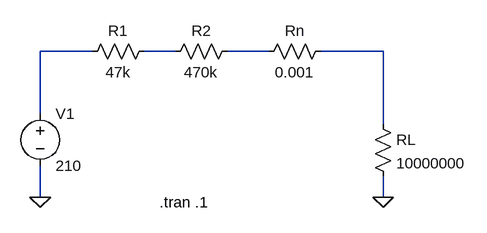
[diagram p0: schematic try2.asc]
try2.asc, the LTspice schematic file:
Version 4
SHEET 1 880 680
WIRE 96 64 16 64
WIRE 224 64 176 64
WIRE 368 64 304 64
WIRE 544 64 448 64
WIRE 16 160 16 64
WIRE 544 176 544 64
WIRE 16 288 16 240
WIRE 544 288 544 256
FLAG 16 288 0
FLAG 544 288 0
SYMBOL voltage 16 144 R0
WINDOW 123 0 0 Left 0
WINDOW 39 0 0 Left 0
SYMATTR InstName V1
SYMATTR Value 210
SYMBOL res 528 160 R0
SYMATTR InstName RL
SYMATTR Value 10000000
SYMBOL res 192 48 R90
WINDOW 0 0 56 VBottom 2
WINDOW 3 32 56 VTop 2
SYMATTR InstName R1
SYMATTR Value 47k
SYMBOL res 320 48 R90
WINDOW 0 0 56 VBottom 2
WINDOW 3 32 56 VTop 2
SYMATTR InstName R2
SYMATTR Value 470k
SYMBOL res 464 48 R90
WINDOW 0 0 56 VBottom 2
WINDOW 3 32 56 VTop 2
SYMATTR InstName Rn
SYMATTR Value 0.001
TEXT 200 296 Left 2 !.tran .1

The netlist it stands for:
* try2.asc
V1 N001 0 210
RL N004 0 10000000
R1 N002 N001 47k
R2 N003 N002 470k
Rn N004 N003 0.001
.tran .1
.backanno
.end